# EAGLE design eyesdrive-rev1 (EAGLE 9.3.0)
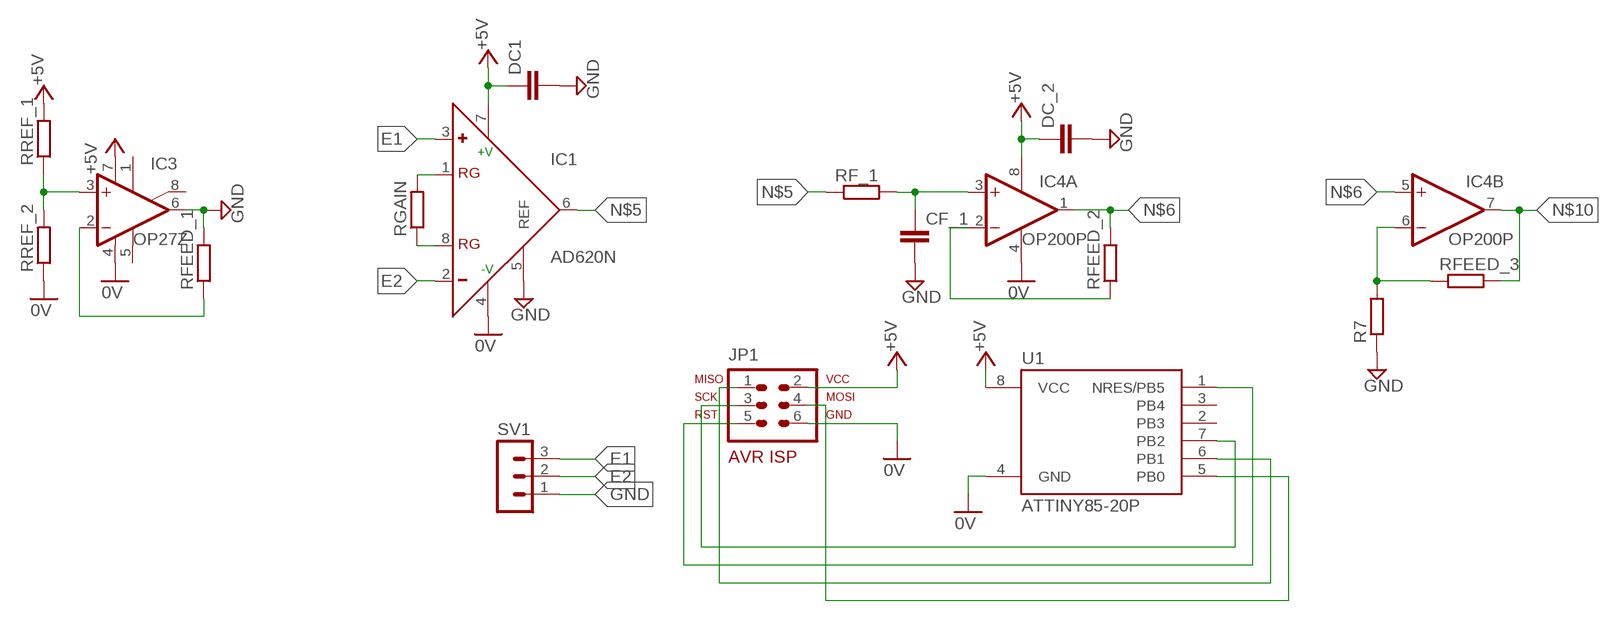
[diagram p0: schematic, sheet 1]

## Parts
CF_1  C-EU025-025X050  [C025-025X050]
DC1  C-EU050-025X075  [C050-025X075]
DC_2  C-EU025-025X050  [C025-025X050]
IC1  AD620N  [DIL08]
IC3  OP27Z  [DIL08]
IC4  OP200P  [DIL08]
JP1  AVR-ISP-6VERT  [AVR-ISP-6]
R7  R-EU_0207/7  [0207/7]
RF_1  R-EU_0207/7  [0207/7]
RFEED_1  R-EU_0207/7  [0207/7]
RFEED_2  R-EU_0207/7  [0207/7]
RFEED_3  R-EU_0207/7  [0207/7]
RGAIN  R-EU_0207/7  [0207/7]
RREF_1  R-EU_0207/7  [0207/7]
RREF_2  R-EU_0207/7  [0207/7]
SV1  MA03-1  [MA03-1]
U1  ATTINY85-20P  [PDIP08_300MIL]

## Nets
0V: IC1.4(-V) IC3.4(V-) IC4.4(P:V-) JP1.6 RREF_2.1 U1.4(GND)
+5V: DC1.1 DC_2.1 IC1.7(+V) IC3.7(V+) IC4.8(P:V+) JP1.2 RREF_1.2 U1.8(VCC)
E1: IC1.3(+) SV1.3
E2: IC1.2(-) SV1.2
GND: CF_1.2 DC1.2 DC_2.2 IC1.5(REF) IC3.6(OUT) R7.1 RFEED_1.2 SV1.1
N$1: IC1.1(RG) RGAIN.2
N$2: IC3.3(+IN) RREF_1.1 RREF_2.2
N$3: IC3.2(-IN) RFEED_1.1
N$4: IC1.8(RG) RGAIN.1
N$5: IC1.6(OUT) RF_1.1
N$6: IC4.1(A:OUT) IC4.5(B:+IN) RFEED_2.2
N$7: IC4.2(A:-IN) RFEED_2.1
N$8: CF_1.1 IC4.3(A:+IN) RF_1.2
N$9: IC4.6(B:-IN) R7.2 RFEED_3.1
N$10: IC4.7(B:OUT) RFEED_3.2
N$11: JP1.3 U1.7(PB2)
N$12: JP1.5 U1.1(NRES/PB5)
N$13: JP1.1 U1.6(PB1)
N$14: JP1.4 U1.5(PB0)
Unconnected: IC3.1(ON1) IC3.5(OPT) IC3.8(ON2) U1.2(PB3) U1.3(PB4)

## Library data of the parts
CF_1 DC1 DC_2 = rcl:C-EU: CAPACITOR, European symbol; SPICEPREFIX: C
IC1 = analog-devices:AD620: Low Cost, Low Power, Instrumentation Amplifier Source: http://www.analog.com/UploadedFiles/Data_Sheets/37793330023930AD620_e.pdf; MF: ALTERA CORPORATION; MPN: AD620AN; OC_FARNELL: 1523782; OC_NEWARK: 05F7108
IC3 = linear:OP27: OP AMP
IC4 = linear:OP200: OP AMP
JP1 = avr-7:AVR-ISP-6: AVR ISP-6 Serial Programming Header
R7 RF_1 RFEED_1-RFEED_3 RGAIN RREF_1 RREF_2 = rcl:R-EU_: RESISTOR, European symbol; SPICEPREFIX: R
SV1 = con-lstb:MA03-1: PIN HEADER; OC_FARNELL: unknown; OC_NEWARK: unknown
U1 = _hhn_attiny25_45_85 2:ATTINY85*: ATMEL ATtiny 85 Packages: P = PDIP 08 30mil S = SOIC 08 EIAJ 208mil Technologies Note: for complete ordering code (temp. range, finish, tape&reel etc.) see www.atmel.com • Supply Voltage: V = (1.8…5.5)V | [blank] = (2.7…5.5)V • Speed: 10 = 10 MHz | 20 = 20 MHz Author: Dipl.-Ing. FH Rainer Bayer HHN Hochschule Heilbronn (Heilbronn University), rainer.bayer@hs-heilbronn.de Ingenieurbüro ing-rb, mail@ing-rb.de

## Board
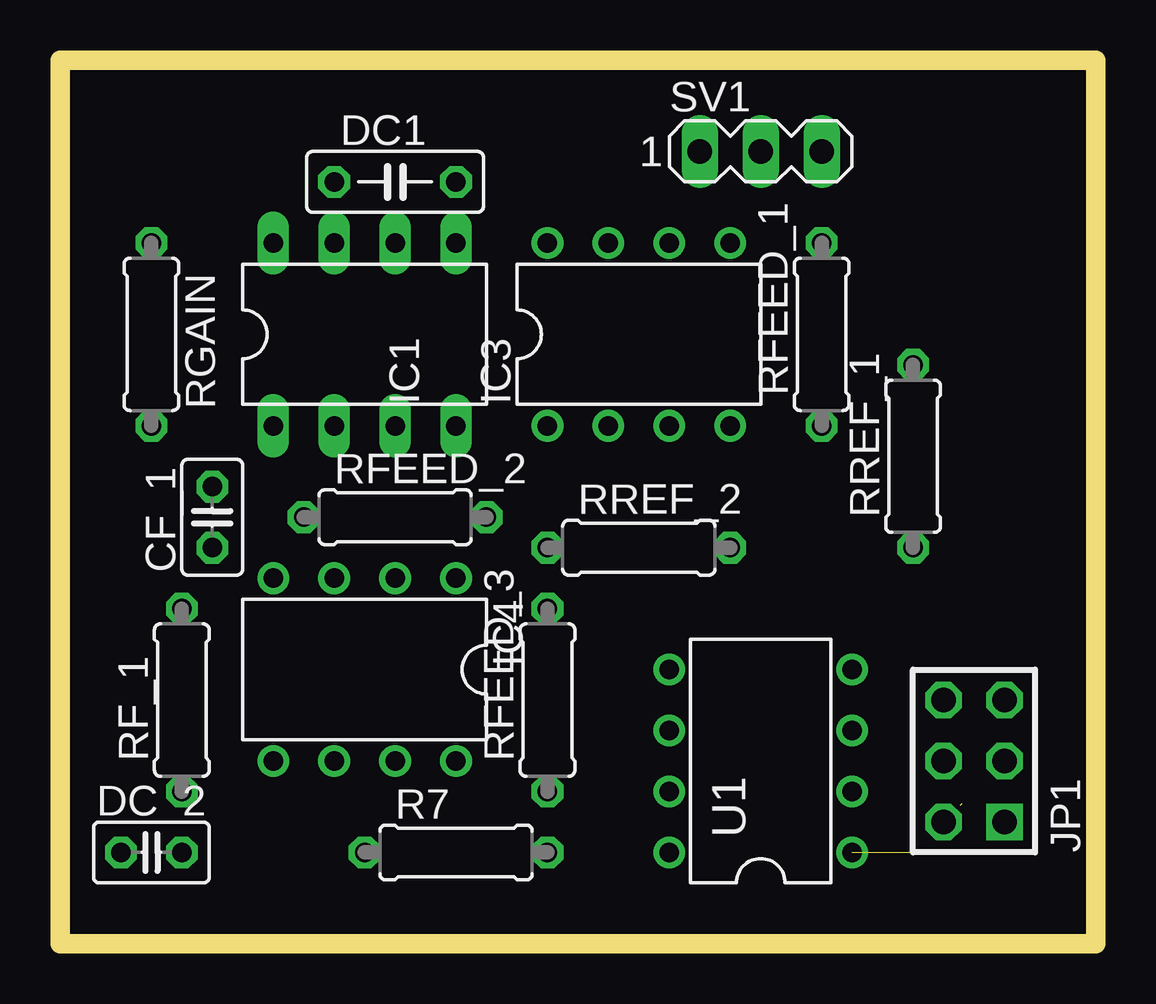
[diagram p1: board, top side]
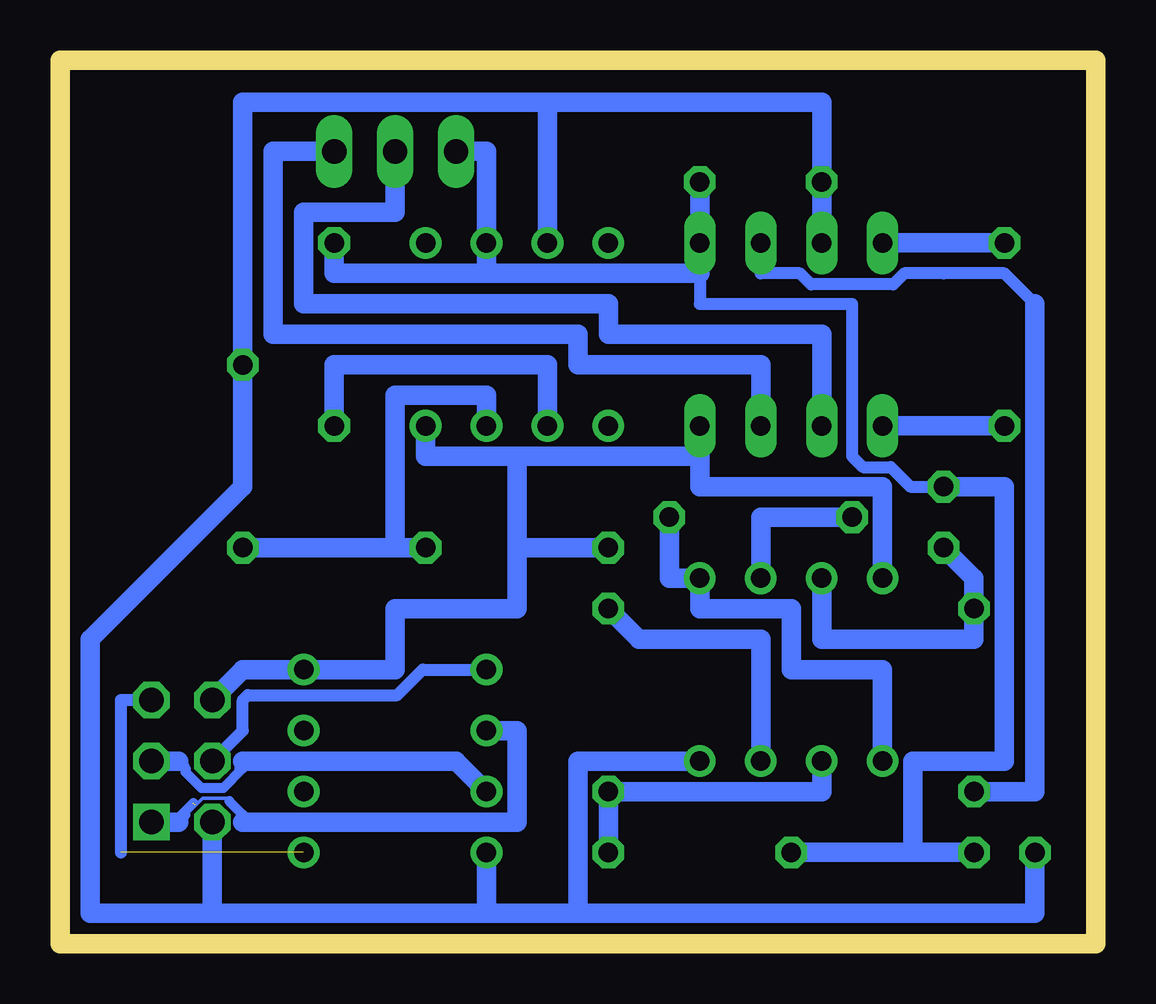
[diagram p2: board, bottom side, seen from below]

Size 43.18 x 36.83 mm. Coordinates in mm from the lower left corner, seen from the top.
Outline: 0,36.83 0,0 43.18,0 43.18,36.83 0,36.83
Copper layers (1*16): Top 0.035mm / dielectric 1.5mm / Bottom 0.035mm
Design rules "default": minimum track width 6mil, minimum drill 0.35mm, track to track 6mil, track to pad 6mil, pad to pad 6mil, via to via 6mil, smd to smd 6mil, copper to edge 40mil, drill to drill 6mil, minimum pad ring 10mil, minimum via ring 8mil, stop-mask expansion 4mil, vias tented up to drill 0mil, thermal gap 10mil

### Footprints (pad centres in the part's own frame; a part is rotated, then mirrored left to right if it is on the bottom)
C025-025X050 = drill 0.813 octagon: 1 -1.27,0; 2 1.27,0
C050-025X075 = drill 0.813 octagon: 1 -2.54,0; 2 2.54,0
DIL08 = drill 0.813 long: 1 -3.81,-3.81; 2 -1.27,-3.81; 3 1.27,-3.81; 4 3.81,-3.81; 5 3.81,3.81; 6 1.27,3.81; 7 -1.27,3.81; 8 -3.81,3.81
DIL08' = drill 0.813 pad 1.27: 1 -3.81,-3.81; 2 -1.27,-3.81; 3 1.27,-3.81; 4 3.81,-3.81; 5 3.81,3.81; 6 1.27,3.81; 7 -1.27,3.81; 8 -3.81,3.81
AVR-ISP-6 = drill 1.016 square: 1 -2.54,-1.27 | drill 1.016 octagon: 2 -2.54,1.27; 3 0,-1.27; 4 0,1.27; 5 2.54,-1.27; 6 2.54,1.27
0207/7 = drill 0.813 octagon: 1 -3.81,0; 2 3.81,0
MA03-1 = drill 1.016 long: 1 -2.54,0; 2 0,0; 3 2.54,0
PDIP08_300MIL = drill 0.813: 1 -3.81,-3.81; 2 -1.27,-3.81; 3 1.27,-3.81; 4 3.81,-3.81; 5 3.81,3.81; 6 1.27,3.81; 7 -1.27,3.81; 8 -3.81,3.81

### Placement (x,y rotation side)
CF_1  6.35,17.78 90 top
DC1  13.97,31.75 0 top
DC_2  3.81,3.81 0 top
IC1  12.7,25.4 0 top
IC3  OP27Z  [DIL08']  24.13,25.4 0 top
IC4  OP200P  [DIL08']  12.7,11.43 180 top
JP1  38.1,7.62 90 top
R7  16.51,3.81 0 top
RF_1  5.08,10.16 90 top
RFEED_1  31.75,25.4 90 top
RFEED_2  13.97,17.78 0 top
RFEED_3  20.32,10.16 90 top
RGAIN  3.81,25.4 270 top
RREF_1  35.56,20.32 90 top
RREF_2  24.13,16.51 0 top
SV1  29.21,33.02 0 top
U1  29.21,7.62 90 top

### Tracks (layer width: path | path; a pad name or v marks a point on that pad's centre or on a via)
0V
  Bottom 0.813: IC1.4 16.51,20.32 | 16.51,20.32 24.13,20.32 | 24.13,20.32 27.94,20.32 IC3.4 | RREF_2.1 24.13,16.51 | 24.13,16.51 24.13,20.32 | IC4.4 8.89,19.05 16.51,19.05 16.51,20.32 | JP1.6 35.56,11.43 U1.4 29.21,11.43 29.21,13.97 24.13,13.97 24.13,16.51
+5V
  Bottom 0.813: IC3.7 22.86,35.08 | 22.86,35.08 35.56,35.08 RREF_1.2 35.56,19.05 41.91,12.7 41.91,1.27 36.83,1.27 | IC1.7 DC1.1 11.43,35.08 22.86,35.08 | IC4.8 21.59,7.62 21.59,1.27 | 21.59,1.27 2.54,1.27 DC_2.1 | 36.83,1.27 JP1.2 | 36.83,1.27 25.4,1.27 | 25.4,1.27 21.59,1.27 | U1.8 25.4,1.27
E1
  Bottom 0.813: 13.97,22.86 IC1.3 13.97,24.13 21.59,24.13 21.59,25.4 34.29,25.4 34.29,33.02 SV1.3
E2
  Bottom 0.813: IC1.2 11.43,25.4 20.32,25.4 20.32,26.67 33.02,26.67 33.02,30.48 29.21,30.48 SV1.2
GND
  Bottom 0.508: IC1.5 16.51,26.67 10.16,26.67 10.16,20.32 9.7,19.86 8.55,19.86 7.74,19.05 CF_1.2
  Bottom 0.813: DC1.2 IC1.5 16.51,27.94 25.4,27.94 | 25.4,27.94 IC3.6 25.4,33.02 SV1.1 | DC_2.2 7.62,3.81 | 7.62,3.81 R7.1 | RFEED_1.2 31.75,27.94 25.4,27.94 | CF_1.2 3.81,19.05 3.81,7.62 7.62,7.62 7.62,3.81
N$1
  Bottom 0.813: RGAIN.2 IC1.1
N$2
  Bottom 0.813: RREF_2.2 29.21,16.51 | IC3.3 25.4,22.86 29.21,22.86 29.21,16.51 | RREF_1.1 29.21,16.51
N$3
  Bottom 0.813: RFEED_1.1 31.75,24.13 22.86,24.13 IC3.2
N$4
  Bottom 0.813: RGAIN.1 IC1.8
N$5
  Bottom 0.508: IC1.6 13.97,27.94 12.33,27.94 11.87,27.48 8.45,27.48 7.99,27.94 6.35,27.94 3.81,27.94 2.54,26.67
  Bottom 0.813: RF_1.1 2.54,6.35 2.54,25.4 2.54,26.67
N$6
  Bottom 0.813: RFEED_2.2 17.78,15.24 IC4.1 16.51,13.97 12.7,13.97 12.7,11.43 8.89,11.43 IC4.5
N$7
  Bottom 0.813: RFEED_2.1 13.97,17.78 IC4.2
N$8
  Bottom 0.813: CF_1.1 5.08,15.24 RF_1.2 5.08,12.7 11.43,12.7 IC4.3
N$9
  Bottom 0.813: IC4.6 11.43,6.35 RFEED_3.1 R7.2
N$10
  Bottom 0.813: RFEED_3.2 19.05,12.7 13.97,12.7 IC4.7
N$11
  Bottom 0.152: 37.24,6.63 36.42,6.63 35.84,7.21 35.84,7.34 35.56,7.62
  Bottom 0.406: 38.23,7.62 37.95,7.34 37.95,7.16 37.29,6.5 36.37,6.5 35.56,7.31 35.56,7.62
  Bottom 0.813: U1.7 26.67,7.62 35.56,7.62 | JP1.3 38.23,7.62
N$12  (1 unrouted)
  Bottom 0.508: JP1.5 40.64,10.16 40.64,3.81
N$13  (1 unrouted)
  Bottom 0.152: 37.53,5.78 37.24,6.07 36.83,6.07 36.42,6.07 36.24,6.07 36.12,5.95
  Bottom 0.406: 36.12,5.95 35.56,5.39 35.56,5.08 | 37.95,5.54 37.95,5.36 38.23,5.08 38.23,5.26 37.95,5.54 | 37.95,5.54 37.62,5.87
  Bottom 0.813: 35.56,5.08 24.13,5.08 24.13,8.89 U1.6 | JP1.1 38.23,5.08
N$14
  Bottom 0.508: JP1.4 35.56,8.89 35.56,10.16 35.36,10.36 29.13,10.36 28.06,11.43 U1.5